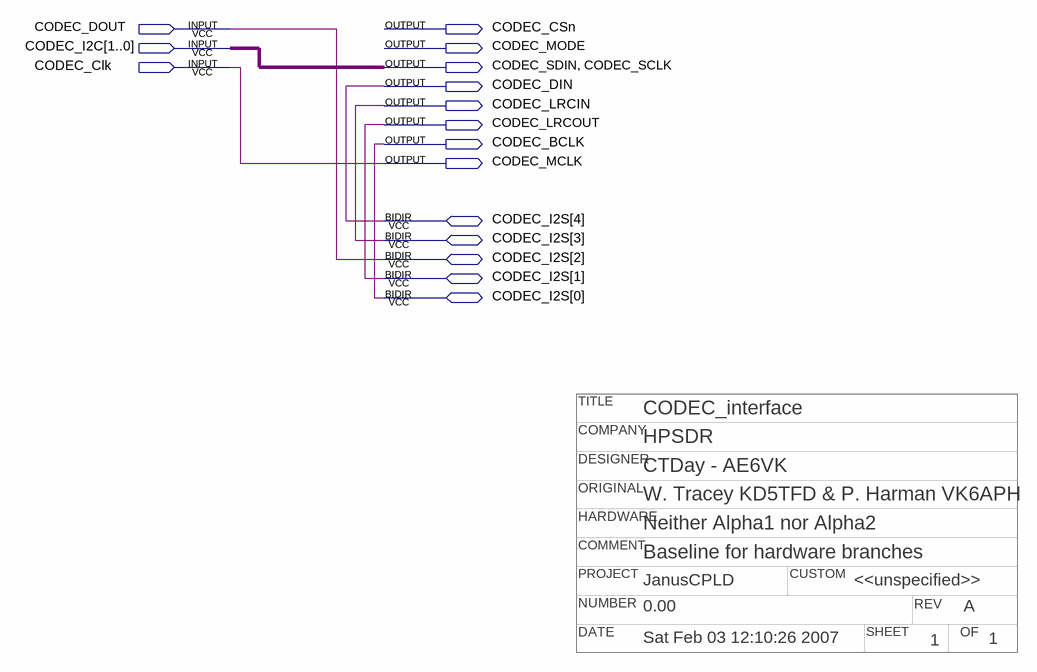
[diagram p0: schematic sheet]
// Quartus schematic CODEC_interface.bdf as structural Verilog: 0 symbols, 16 pins
// Title block: TITLE: CODEC_interface; COMPANY: HPSDR; DESIGNER: CTDay - AE6VK; NUMBER: 0.00; REV: A; DATE: Sat Feb 03 12:10:26 2007; SHEET: 1; OF: 1; ORIGINAL: W. Tracey KD5TFD & P. Harman VK6APH; HARDWARE: Neither Alpha1 nor Alpha2; COMMENT: Baseline for hardware branches; PROJECT: JanusCPLD; CUSTOM: <<unspecified>>
module CODEC_interface (
  input  CODEC_DOUT,
  input  [1:0] CODEC_I2C,
  input  CODEC_Clk,
  inout  [4:0] CODEC_I2S,
  output CODEC_CSn,
  output CODEC_MODE,
  output CODEC_SDIN,
  output CODEC_SCLK,
  output CODEC_DIN,
  output CODEC_LRCIN,
  output CODEC_LRCOUT,
  output CODEC_BCLK,
  output CODEC_MCLK
);


  assign CODEC_BCLK = CODEC_I2S[0];
  assign CODEC_DIN = CODEC_I2S[4];
  assign CODEC_I2S[2] = CODEC_DOUT;
  assign CODEC_LRCIN = CODEC_I2S[3];
  assign CODEC_LRCOUT = CODEC_I2S[1];
  assign CODEC_MCLK = CODEC_Clk;
  assign CODEC_SCLK = CODEC_I2C[0];
  assign CODEC_SDIN = CODEC_I2C[1];
endmodule
